# Altium schematic sheet 5VPrimary.SchDoc
size A; SheetNumber: 5; SheetTotal: 12
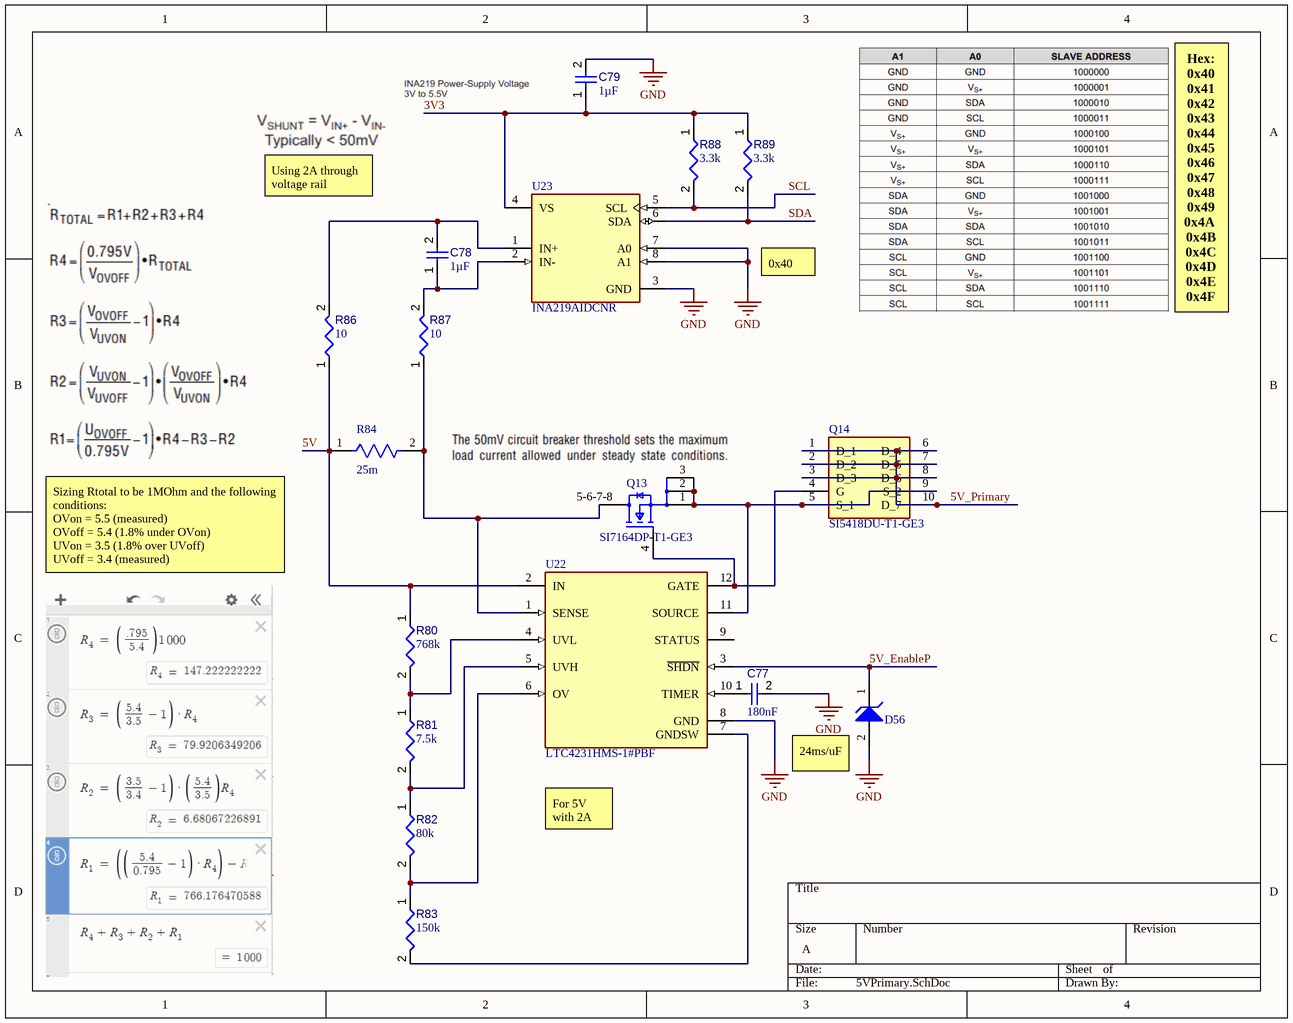
[diagram p0: 5VPrimary.SchDoc]

## Parts
C77  value 180nF  [FP-C0805C-DN-IPC_A]  (hidden comment: C0805C184K5RACTU)
C78  value 1µF  [CAPC1608X90X40LL10T20]  (hidden comment: Capacitor 1 uF +/- 10% 25 V 0603)
C79  value 1µF  [CAPC1608X90X35ML15T15]  (hidden comment: Capacitor 1uF +/- 10% 16V 0603)
D56  MM3Z3V6T1G  [ONSC-SOD-323-2-477-02_V]  (value not drawn)
Q13  SI7164DP-T1-GE3  [Vishay_S17-0173-SINGLE_MFG]
Q14  SI5418DU-T1-GE3  [SI5418DU-T1-GE3-Footprint-1]
R80  value 768k  [RESC0402(1005)_L]  (hidden comment: 768KR2F)
R81  value 7.5k  [FP-CRCW1206-e3-IPC_A]  (hidden comment: CRCW12067K50FKEA)
R82  value 80k  [FP-PTN0603-IPC_B]  (hidden comment: PTN0603E8002BST1)
R83  value 150k  [FP-RT1206-IPC_C]  (hidden comment: RT1206FRE07150KL)
R84  Resistance: 25m  [FP-CSR1206-IPC_C]  (hidden comment: CSR1206FK25L0)
R86  value 10  [RESC0402(1005)_L]  (hidden comment: Resistor 10R  +/-1 % 0402 63 mW)
R87  value 10  [RESC0402(1005)_L]  (hidden comment: Resistor 10R  +/-1 % 0402 63 mW)
R88  value 3.3k  [FP-CRCW1210-e3-IPC_C]  (hidden comment: CRCW12103K30JNEA)
R89  value 3.3k  [FP-CRCW1210-e3-IPC_C]  (hidden comment: CRCW12103K30JNEA)
U22  LTC4231HMS-1#PBF  [FP-MS-12-05-08-1668-MFG]
U23  INA219AIDCNR  [FP-DCN0008A-IPC_A]

## Nets
GND: C77.2 C79.2 D56.2(A) U22.8(GND) U23.3(GND) U23.7(A0) U23.8(A1)
3V3: C79.1 R88.1 R89.1 U23.4(VS)
5V: R80.1 R84.1 R86.1 U22.2(IN)
5V_EnableP: D56.1(K) U22.3(~{SHDN})
5V_Primary: Q14.1(D_1) Q14.2(D_2) Q14.3(D_3) Q14.6(D_4) Q14.7(D_5) Q14.8(D_6) Q14.10(D_7)
SCL: R88.2 U23.5(SCL)
SDA: R89.2 U23.6(SDA)
NetC77_1: C77.1 U22.10(TIMER)
NetC78_1: C78.1 R87.2 U23.2(IN-)
NetC78_2: C78.2 R86.2 U23.1(IN+)
NetQ13_1: Q13.1(S) Q13.2(S) Q13.3(S) Q14.5(S_1) Q14.9(S_2) U22.11(SOURCE)
NetQ13_4: Q13.4(G) Q14.4(G) U22.12(GATE)
NetQ13_5-6-7-8: Q13.5-6-7-8(D) R84.2 R87.1 U22.1(SENSE)
NetR80_2: R80.2 R81.1 U22.4(UVL)
NetR81_2: R81.2 R82.1 U22.5(UVH)
NetR82_2: R82.2 R83.1 U22.6(OV)
NetR83_2: R83.2 U22.7(GNDSW)

Not connected (* = marked no-connect by the designer): U22 9(STATUS)

## Notes on the sheet
- Using 2A through voltage rail
- 0x40
- Hex:
  0x40
  0x41
  0x42
  0x43
  0x44
  0x45
  0x46
  0x47
  0x48
  0x49
  0x4A
  0x4B
  0x4C
  0x4D
  0x4E
  0x4F
- Sizing Rtotal to be 1MOhm and the following conditions:
  OVon = 5.5 (measured)
  OVoff = 5.4 (1.8% under OVon)
  UVon = 3.5 (1.8% over UVoff)
  UVoff = 3.4 (measured)
- (near D56) 24ms/uF
- For 5V
  with 2A

## Library data of the parts
C77 = CMP-001-00086-1: Ceramic Capacitor, Multilayer, Ceramic, 50V, 10% +Tol, 10% -Tol, X7R, 15% TC, 0.18uF, Surface Mount, 0805; Capacitor Type: Ceramic; Mounting Technology: Surface Mount; Pins: 2; Min Operating Temperature: -55°C; Case/Package: 0805; Max Operating Temperature: 125°C; RoHS Compliant: Yes
C78 = CMP-001-00005-6: Chip Capacitor, 1 uF, +/- 10%, 25 V, 0603 (1608 Metric); Capacitor Type: Ceramic; Voltage Rating: 25V; Pins: 2; Mounting Technology: SM; RoHS Compliant: True; Max Operating Temperature: 125°C; Case/Package: 0603; Min Operating Temperature: -55°C; Tolerance: 10%
C79 = CMP-001-00004-6: Chip Capacitor, 1 uF, +/- 10%, 16 V, 0603 (1608 Metric); Capacitor Type: Ceramic; Mounting Technology: SM; RoHS Compliant: True; Min Operating Temperature: -55°C; Case/Package: 0603; Pins: 2; Voltage Rating: 16V; Max Operating Temperature: 125°C; Tolerance: 10%
D56 = CMP-1060-00650-1: Zener Voltage Regulator, 300 mW, 2-Pin SOD-323, Pb-Free, Tape and Reel; Manufacturer: On Semiconductor; VZ Typ (V): 3.6; P Max (W): 0.3; RoHS: Pb-Free; ComponentLink1URL: http://www.onsemi.com/; PackageVersion: Rev. H, 03/2007; PartNumber: MM3Z3V6T1G; ComponentLink2Description: Datasheet; ComponentLink2URL: http://www.onsemi.cn/pub_link/Collateral/MM3Z2V4T1-D.PDF; DatasheetVersion: Rev. 9; PackageReference: SOD-323-2-477-02; ComponentLink3URL: http://www.onsemi.com/pub_link/Collateral/477-02.PDF.1; Packing: Tape and Reel; Mounting Technology: Surface Mount; ComponentLink3Description: Package Specification; PackageDescription: 2-Pin SOD, Body 1.7 x 1.25 mm; ComponentLink1Description: Manufacturer URL
Q13 = CMP-013-00040-1: Power Field-Effect Transistor, 23.5A I(D), 60V, 0.00625ohm, 1-Element, N-Channel, Silicon, Metal-oxide Semiconductor FET; Pins: 5; RoHS Compliant: Yes; Max Operating Temperature: 150°C
Q14 = CMP-013-00041-1: Power Field-Effect Transistor, 11.6A I(D), 30V, 0.0145ohm, 1-Element, N-Channel, Silicon, Metal-oxide Semiconductor FET; Max Operating Temperature: 150°C; RoHS Compliant: Yes; Pins: 3
R80 = CMP-009-00110-2: 768K 0.063W 1% 0402 (1005 Metric)  SMD; Power: 63mW; Tolerance: 1%; Mounting Technology: SMT; Pins: 2; Case/Package: 0402
R81 = CMP-009-00195-1: Fixed Resistor, Metal Glaze/thick Film, 0.25W, 7500ohm, 200V, 1% +/-Tol, 100ppm/Cel, Surface Mount, 1206; Power: 250mW; RoHS Compliant: Yes; Pins: 2; Tolerance: 1%; Min Operating Temperature: -55°C; Max Operating Temperature: 155°C; Case/Package: 1206; Mounting Technology: Surface Mount
R82 = CMP-009-00194-1: Fixed Resistor, Thin Film, 0.15W, 80000ohm, 75V, 0.1% +/-Tol, 25ppm/Cel, Surface Mount, 0603; Power: 150mW; Case/Package: 0603; RoHS Compliant: Yes; Pins: 2; Mounting Technology: Surface Mount; Max Operating Temperature: 150°C; Tolerance: 0.1%; Min Operating Temperature: -55°C
R83 = CMP-009-00193-1: Fixed Resistor, Thin Film, 0.25W, 150000ohm, 200V, 1% +/-Tol, 50ppm/Cel, Surface Mount, 1206; Power: 250mW; Pins: 2; Case/Package: 1206; Tolerance: 1%; Mounting Technology: Surface Mount; Max Operating Temperature: 155°C; RoHS Compliant: Yes; Min Operating Temperature: -55°C
R84 = CMP-26527-000133-1: General Purpose Thick Film Chip Resistor, 1206, 25mΩ, 1%, 0.5W; Max Power Dissipation: 500mW; Temperature Coefficient: 100ppm/°C; Lead Free: Lead Free; Military Standard: Not; Case Code (Imperial): 1206; Max Operating Temperature: 155°C; Case Code (Metric): 3216; Height: 0.026inch; Packaging: Tape and Reel; Case/Package: 1206; Series: CSR; Number of Terminations: 2; RoHS Compliant: Yes; Mount: Surface Mount; Depth: 1.55mm; Contact Plating: Tin; Length: 0.12inch; Radiation Hardening: No; Width: 0.061inch; Size Code: 1206; Power Rating: 500mW; Min Operating Temperature: -55°C; Tolerance: 1%; Resistor Type: Thick Film; Construction: Rectangular
R86 R87 = CMP-009-00152-3: Chip Resistor, 10 Ohms, +/-1 %, 63 mW, -55 to 155 degC, 0402; Tolerance: 1%; Power: 63mW; Pins: 2; Max Operating Temperature: 155°C; Min Operating Temperature: -55°C; Case/Package: 0402
R88 R89 = CMP-009-00192-1: Fixed Resistor, Metal Glaze/thick Film, 0.5W, 3300ohm, 200V, 5% +/-Tol, 200ppm/Cel, Surface Mount, 1210; Power: 500mW; RoHS Compliant: Yes; Max Operating Temperature: 155°C; Case/Package: 1210; Min Operating Temperature: -55°C; Mounting Technology: Surface Mount; Tolerance: 5%; Pins: 2
U22 = CMP-09134-000012-1: IC HOT SWAP CTRLR GP 12MSOP; Operating Supply Current: 4uA; Number of Channels: 1; Min Supply Voltage: 2.7V; Max Supply Voltage: 36V; Number of Pins: 12; Features: Latched Fault; Max Operating Temperature: 125°C; Mount: Surface Mount; Packaging: Rail/Tube; Min Operating Temperature: -40°C; REACH SVHC: No SVHC; Case/Package: MSOP; RoHS Compliant: Yes
U23 = CMP-010-00025-1: Power Supply Support Circuit, Fixed, 2 Channel, 2V, PDSO8; Nominal Supply Voltage: 3.3V; Max Supply Voltage: 5.5V; Min Supply Voltage: 3V; Case/Package: LSSOP; Max Operating Temperature: 125°C; Min Operating Temperature: -40°C; Pins: 8; RoHS Compliant: Yes